# EAGLE design omenpia (EAGLE 9.1.3)
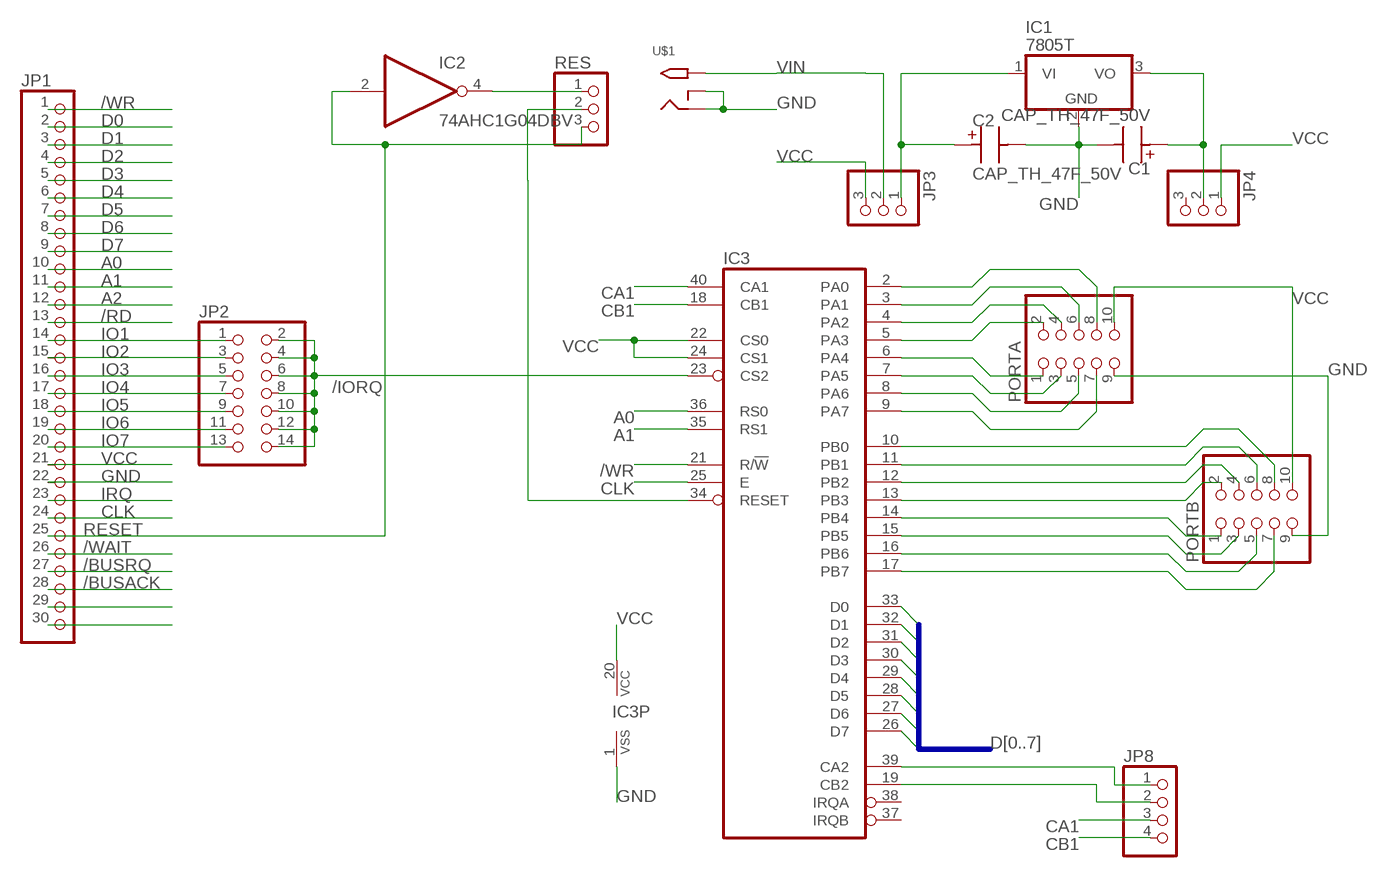
[diagram p0: schematic, sheet 1]

## Parts
C1  CAP_TH_47F_50V  [CAP_TH_P25_D63_POL]
C2  CAP_TH_47F_50V  [CAP_TH_P25_D63_POL]
IC1  7805T  [TO220H]
IC2  74AHC1G04DBV  [SOT23-5]
IC3  6821  [DIL40]
JP1  PINHD-1X30  [1X30]
JP2  PINHD-2X7  [2X07]
JP3  PINHD-1X3  [1X03]
JP4  PINHD-1X3  [1X03]
JP8  PINHD-1X4  [1X04]
PORTA  PINHD-2X5  [2X05]
PORTB  PINHD-2X5  [2X05]
RES  PINHD-1X3  [1X03]
U$1  2.1MMJACKTHM  [PJ-102A]

## Nets
/BUSACK: JP1.28
/BUSRQ: JP1.27
/IORQ: IC3.23(CS2) JP2.2 JP2.4 JP2.6 JP2.8 JP2.10 JP2.12 JP2.14
/RD: JP1.13
/WAIT: JP1.26
/WR: IC3.21(R/!W) JP1.1
A0: IC3.36(RS0) JP1.10
A1: IC3.35(RS1) JP1.11
A2: JP1.12
CA1: IC3.40(CA1) JP8.3
CB1: IC3.18(CB1) JP8.4
CLK: IC3.25(E) JP1.24
D0: IC3.33(D0) JP1.2
D1: IC3.32(D1) JP1.3
D2: IC3.31(D2) JP1.4
D3: IC3.30(D3) JP1.5
D4: IC3.29(D4) JP1.6
D5: IC3.28(D5) JP1.7
D6: IC3.27(D6) JP1.8
D7: IC3.26(D7) JP1.9
GND: C1.P$M C2.P$M IC1.2(GND) IC3.1(VSS) JP1.22 PORTA.9 PORTB.9 U$1.RING U$1.RING_SW
IO1: JP1.14 JP2.1
IO2: JP1.15 JP2.3
IO3: JP1.16 JP2.5
IO4: JP1.17 JP2.7
IO5: JP1.18 JP2.9
IO6: JP1.19 JP2.11
IO7: JP1.20 JP2.13
IRQ: JP1.23
N$1: IC3.5(PA3) PORTA.2
N$2: C2.P$P IC1.1(VI) JP3.1
N$3: C1.P$P IC1.3(VO) JP4.2
N$4: IC2.4(O) RES.1
N$5: IC3.4(PA2) PORTA.4
N$6: IC3.34(RESET) RES.2
N$7: IC3.3(PA1) PORTA.6
N$8: IC3.2(PA0) PORTA.8
N$9: IC3.6(PA4) PORTA.1
N$10: IC3.7(PA5) PORTA.3
N$11: IC3.8(PA6) PORTA.5
N$12: IC3.9(PA7) PORTA.7
N$13: IC3.10(PB0) PORTB.8
N$14: IC3.13(PB3) PORTB.2
N$15: IC3.12(PB2) PORTB.4
N$16: IC3.11(PB1) PORTB.6
N$17: IC3.14(PB4) PORTB.1
N$18: IC3.15(PB5) PORTB.3
N$19: IC3.16(PB6) PORTB.5
N$20: IC3.17(PB7) PORTB.7
N$21: IC3.39(CA2) JP8.1
N$22: IC3.19(CB2) JP8.2
N$29: JP1.29
N$30: JP1.30
RESET: IC2.2(I) JP1.25 RES.3
VCC: IC3.20(VCC) IC3.22(CS0) IC3.24(CS1) JP1.21 JP3.3 JP4.1 PORTA.10 PORTB.10
VIN: JP3.2 U$1.TIP
Unconnected: IC3.37(IRQB) IC3.38(IRQA) JP4.3

## Buses
D[0..7]

## Power pins joined to a net without a drawn wire
GND: IC2.3(GND)
VCC: IC2.5(VCC)

## Library data of the parts
C1 C2 = Seeed-OPL-2017-01-Capacitor-akita:CAP_TH_47F_50V: DIP CAP Aluminum 47uF-50V;Radial-D6.3*H11.0mm SKU: 302030036
IC1 = adafruit:78*: Positive VOLTAGE REGULATOR Added bigger pads to the TO-92 package
IC2 = 74xx-little-us:74*1G04: INVERTER Gate
IC3 = micro-motorola:6821: MICROCONTROLLER/MEMORY DEVICE; MF: NTE ELECTRONICS; MPN: NTE6821; OC_FARNELL: 1652403; OC_NEWARK: 29C4772
JP1 = pinhead:PINHD-1X30: PIN HEADER
JP2 = pinhead:PINHD-2X7: PIN HEADER
JP3 JP4 RES = pinhead:PINHD-1X3: PIN HEADER
JP8 = pinhead:PINHD-1X4: PIN HEADER
PORTA PORTB = pinhead:PINHD-2X5: PIN HEADER
U$1 = adafruit:2.1MMJACK: 2.1mm x 5.5mm THM DC jack with internal switch. Digikey part #PJ-102A, 4UCON part #05537 2.1mm x 5.5mm SMT DC jack with internal switch. Digikey part #PJ-002A-SMT, 4UCON part #03267 By microbuilder.eu & adafruit.com

## Board
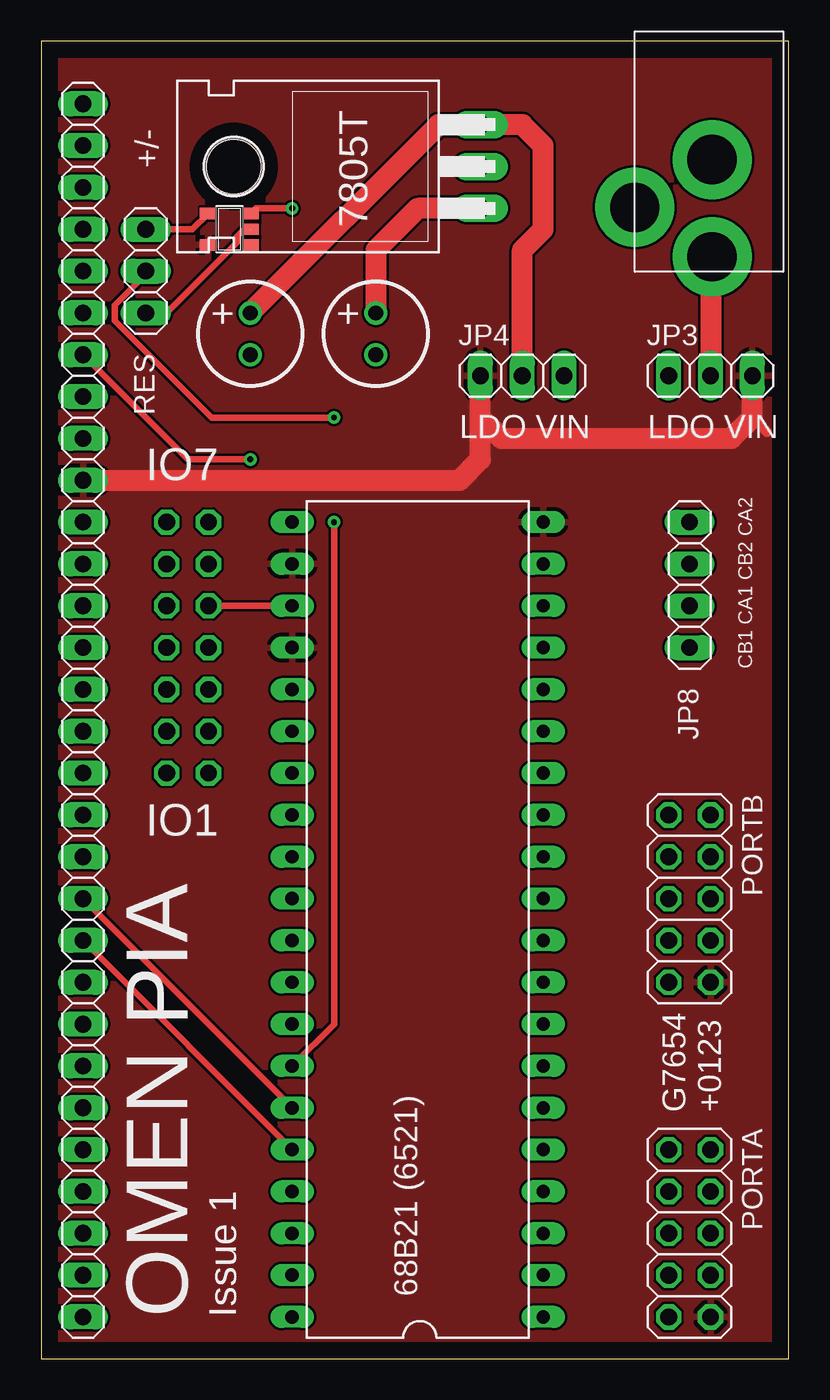
[diagram p1: board, top side]
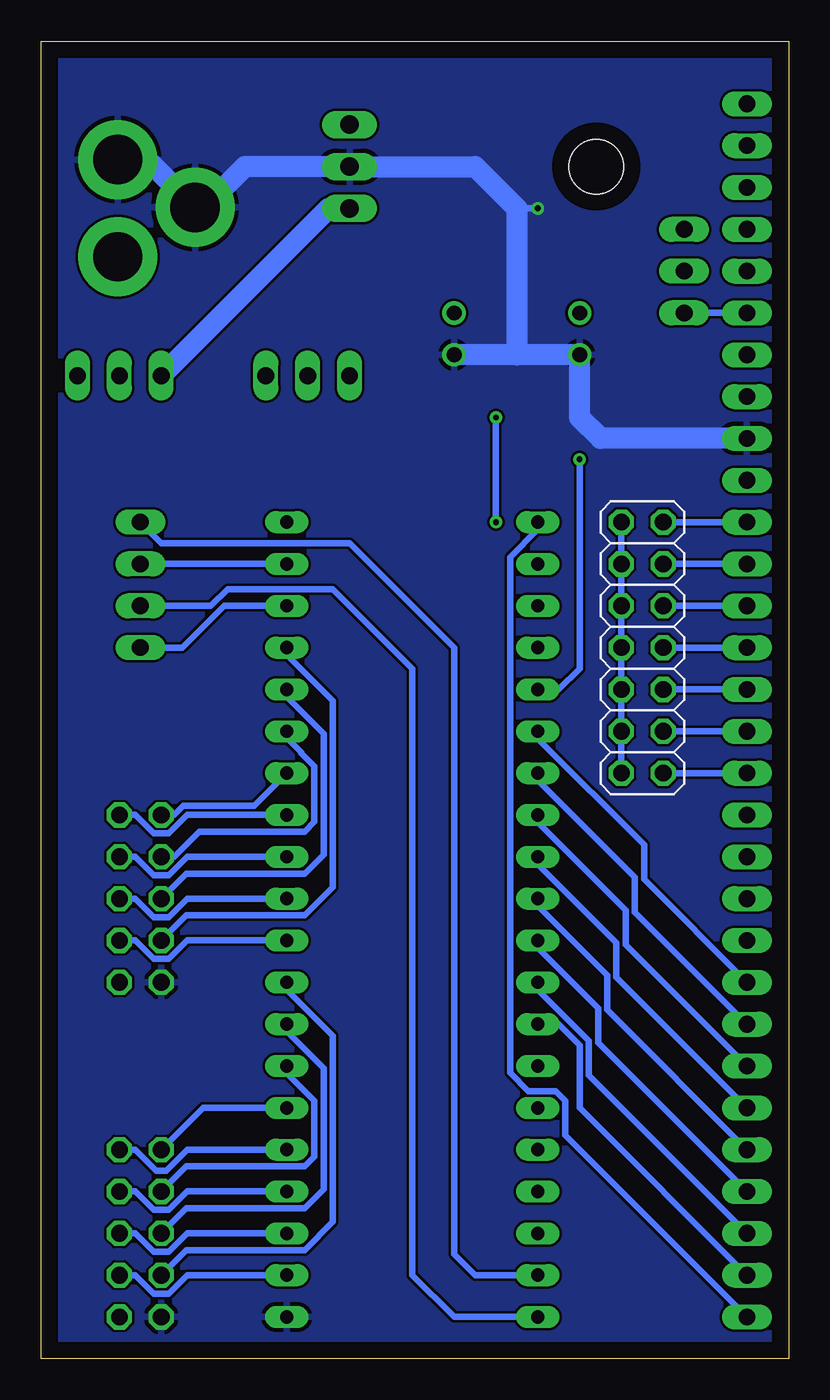
[diagram p2: board, bottom side, seen from below]

Size 45.39 x 80 mm. Coordinates in mm from the lower left corner, seen from the top.
Outline: 0,0 45.39,0 45.39,80 0,80 0,0
Copper layers (1*16): Top 0.035mm / dielectric 1.5mm / Bottom 0.035mm
Design rules "default": minimum track width 6mil, minimum drill 0.35mm, track to track 6mil, track to pad 6mil, pad to pad 6mil, via to via 6mil, smd to smd 6mil, copper to edge 40mil, drill to drill 6mil, minimum pad ring 10mil, minimum via ring 8mil, stop-mask expansion 4mil, vias tented up to drill 0mil, thermal gap 10mil

### Footprints (pad centres in the part's own frame; a part is rotated, then mirrored left to right if it is on the bottom)
CAP_TH_P25_D63_POL = drill 0.9: P$M 1.27,0; P$P -1.27,0
TO220H = drill 1.118 long: 1 -2.54,-10.16; 2 0,-10.16; 3 2.54,-10.16 | hole 3.302: 0,4.826
SOT23-5 = smd 0.69 x 0.99: 1 -0.95,-1.29; 2 0,-1.29; 3 0.95,-1.29; 4 0.95,1.3; 5 -0.95,1.3
DIL40 = drill 0.813 long: 1 -24.13,-7.62; 2 -21.59,-7.62; 3 -19.05,-7.62; 4 -16.51,-7.62; 5 -13.97,-7.62; 6 -11.43,-7.62; 7 -8.89,-7.62; 8 -6.35,-7.62; 9 -3.81,-7.62; 10 -1.27,-7.62; 11 1.27,-7.62; 12 3.81,-7.62; 13 6.35,-7.62; 14 8.89,-7.62; 15 11.43,-7.62; 16 13.97,-7.62; 17 16.51,-7.62; 18 19.05,-7.62; 19 21.59,-7.62; 20 24.13,-7.62; 21 24.13,7.62; 22 21.59,7.62; 23 19.05,7.62; 24 16.51,7.62; 25 13.97,7.62; 26 11.43,7.62; 27 8.89,7.62; 28 6.35,7.62; 29 3.81,7.62; 30 1.27,7.62; 31 -1.27,7.62; 32 -3.81,7.62; 33 -6.35,7.62; 34 -8.89,7.62; 35 -11.43,7.62; 36 -13.97,7.62; 37 -16.51,7.62; 38 -19.05,7.62; 39 -21.59,7.62; 40 -24.13,7.62
1X30 = drill 1.016 long: 1 -36.83,0; 2 -34.29,0; 3 -31.75,0; 4 -29.21,0; 5 -26.67,0; 6 -24.13,0; 7 -21.59,0; 8 -19.05,0; 9 -16.51,0; 10 -13.97,0; 11 -11.43,0; 12 -8.89,0; 13 -6.35,0; 14 -3.81,0; 15 -1.27,0; 16 1.27,0; 17 3.81,0; 18 6.35,0; 19 8.89,0; 20 11.43,0; 21 13.97,0; 22 16.51,0; 23 19.05,0; 24 21.59,0; 25 24.13,0; 26 26.67,0; 27 29.21,0; 28 31.75,0; 29 34.29,0; 30 36.83,0
2X07 = drill 1.016 octagon: 1 -7.62,-1.27; 2 -7.62,1.27; 3 -5.08,-1.27; 4 -5.08,1.27; 5 -2.54,-1.27; 6 -2.54,1.27; 7 0,-1.27; 8 0,1.27; 9 2.54,-1.27; 10 2.54,1.27; 11 5.08,-1.27; 12 5.08,1.27; 13 7.62,-1.27; 14 7.62,1.27
1X03 = drill 1.016 long: 1 -2.54,0; 2 0,0; 3 2.54,0
1X04 = drill 1.016 long: 1 -3.81,0; 2 -1.27,0; 3 1.27,0; 4 3.81,0
2X05 = drill 1.016 octagon: 1 -5.08,-1.27; 2 -5.08,1.27; 3 -2.54,-1.27; 4 -2.54,1.27; 5 0,-1.27; 6 0,1.27; 7 2.54,-1.27; 8 2.54,1.27; 9 5.08,-1.27; 10 5.08,1.27
PJ-102A = drill 3 pad 4.8: RING 0.1,-3.39; RING_SW -4.6,-6.29; TIP 0.1,-9.29

### Placement (x,y rotation side)
C1  12.7,62.23 270 top
C2  20.32,62.23 270 top
IC1  16.51,72.39 90 top
IC2  11.43,68.58 90 top
IC3  22.86,26.67 90 top
JP1  2.54,39.37 90 top
JP2  8.89,43.18 90 bottom
JP3  40.64,59.69 0 top
JP4  29.21,59.69 0 top
JP8  39.37,46.99 270 top
PORTA  39.37,7.62 270 top
PORTB  39.37,27.94 270 top
RES  6.35,66.04 270 top
U$1  40.64,76.2 0 top

### Tracks (layer width: path | path; a pad name or v marks a point on that pad's centre or on a via)
/IORQ
  Top 0.406: IC3.23 JP2.10
  Bottom 0.406: JP2.14 JP2.12 JP2.10 JP2.8 JP2.6 JP2.4 JP2.2
/WR
  Bottom 0.406: IC3.21 15.24,50.36 16.92,48.68 16.92,17.36 15.81,16.26 14.16,16.26 13.56,15.66 13.56,13.56 JP1.1
A0
  Top 0.406: JP1.10 IC3.36
A1
  Top 0.406: JP1.11 IC3.35
CA1
  Bottom 0.406: JP8.3 35.08,45.72 34.06,46.74 27.69,46.74 22.86,41.91 22.86,5.08 20.32,2.54 IC3.40
CB1
  Bottom 0.406: IC3.18 34.29,45.72 36.83,43.18 JP8.4
CLK  (via drill 0.35)
  Top 0.406: JP1.24 8.89,54.61 v12.7,54.61
  Bottom 0.406: IC3.25 13.97,40.64 12.7,41.91 v12.7,54.61
D0
  Bottom 0.406: JP1.2 12.7,15.24 12.7,19.05 13.97,20.32 IC3.33
D1
  Bottom 0.406: JP1.3 12.14,17.22 12.14,19.32 15.24,22.42 IC3.32
D2
  Bottom 0.406: JP1.4 11.58,19.2 11.58,21.3 15.24,24.96 IC3.31
D3
  Bottom 0.406: JP1.5 11.02,21.18 11.02,23.28 15.24,27.5 IC3.30
D4
  Bottom 0.406: JP1.6 10.46,23.16 10.46,25.26 15.24,30.04 IC3.29
D5
  Bottom 0.406: JP1.7 9.91,25.15 9.91,27.24 15.24,32.58 IC3.28
D6
  Bottom 0.406: JP1.8 9.35,27.13 9.35,29.22 15.24,35.12 IC3.27
D7
  Bottom 0.406: JP1.9 8.79,29.11 8.79,31.21 15.24,37.66 IC3.26
GND  (via drill 0.35)
  Top 0.406: IC2.3 13.04,69.85 v15.24,69.85
  Bottom 0.406: v15.24,69.85 16.51,69.85
  Bottom 1.27: U$1.RING 38.94,72.81 U$1.RING_SW 35.98,69.85 35.56,69.85 33.02,72.39 IC1.2 19.05,72.39 16.51,69.85 16.51,60.96 | JP1.22 11.43,55.88 12.7,57.15 C1.P$M 16.51,60.96 | 16.51,60.96 C2.P$M
  pour Bottom: 0,80.01 45.72,80.01 45.72,0 0,0
IO1
  Bottom 0.406: JP1.14 JP2.1
IO2
  Bottom 0.406: JP1.15 JP2.3
IO3
  Bottom 0.406: JP1.16 JP2.5
IO4
  Bottom 0.406: JP1.17 JP2.7
IO5
  Bottom 0.406: JP1.18 JP2.9
IO6
  Bottom 0.406: JP1.19 JP2.11
IO7
  Bottom 0.406: JP1.20 JP2.13
N$1
  Bottom 0.406: IC3.5 36.52,12.7 37.79,11.43 38.41,11.43 39.68,12.7 PORTA.2
N$2
  Top 1.27: IC1.1 22.86,69.85 20.32,67.31 C2.P$P
  Bottom 1.27: JP3.1 27.94,69.85 IC1.1
N$3
  Top 1.27: C1.P$P 24.13,74.93 IC1.3 29.21,74.93 30.48,73.66 30.48,68.58 29.21,67.31 JP4.2
N$4
  Top 0.406: RES.1 9.18,68.58 IC2.4
N$5
  Bottom 0.406: IC3.4 36.52,10.16 37.64,9.04 38.56,9.04 39.68,10.16 PORTA.4
N$6  (via drill 0.35)
  Top 0.406: IC3.34 17.78,20.32 v17.78,50.8 | RES.2 6.35,65.84 4.47,63.96 4.47,63.04 10.36,57.15 v17.78,57.15
  Bottom 0.406: v17.78,50.8 v17.78,57.15
N$7
  Bottom 0.406: IC3.3 36.52,7.62 37.64,6.5 38.56,6.5 39.68,7.62 | 39.68,7.62 PORTA.6 39.68,7.62
N$8
  Bottom 0.406: IC3.2 36.52,5.08 37.64,3.96 38.56,3.96 39.68,5.08 PORTA.8
N$9
  Bottom 0.406: IC3.6 35.56,15.24 PORTA.1
N$10
  Bottom 0.406: PORTA.3 36.58,11.68 29.4,11.68 28.8,12.28 28.8,15.66 30.48,17.34 IC3.7
N$11
  Bottom 0.406: IC3.8 30.48,19.88 28.25,17.64 28.25,10.3 29.4,9.14 36.58,9.14 PORTA.5
N$12
  Bottom 0.406: IC3.9 30.48,22.42 27.69,19.62 27.69,8.32 29.4,6.6 36.58,6.6 PORTA.7
N$13
  Bottom 0.406: PORTB.8 39.68,25.4 38.56,24.28 37.64,24.28 36.52,25.4 IC3.10
N$14
  Bottom 0.406: PORTB.2 39.68,33.02 38.56,31.9 37.64,31.9 36.52,33.02 IC3.13
N$15
  Bottom 0.406: PORTB.4 39.68,30.48 38.56,29.36 37.64,29.36 36.52,30.48 IC3.12
N$16
  Bottom 0.406: PORTB.6 39.68,27.94 38.56,26.82 37.64,26.82 36.52,27.94 IC3.11
N$17
  Bottom 0.406: PORTB.1 37.31,33.02 36.75,33.58 32.46,33.58 IC3.14
N$18
  Bottom 0.406: PORTB.3 37.31,30.48 35.79,32 29.4,32 28.8,32.6 28.8,35.98 29.59,36.77 29.59,36.83 30.48,37.72 IC3.15
N$19
  Bottom 0.406: IC3.16 30.48,40.2 28.25,37.96 28.25,30.62 29.4,29.46 36.58,29.46 PORTB.5
N$20
  Bottom 0.406: IC3.17 30.48,42.74 27.69,39.94 27.69,28.64 29.4,26.92 36.58,26.92 PORTB.7
N$21
  Bottom 0.406: JP8.1 38.1,49.53 26.67,49.53 20.32,43.18 20.32,6.35 19.05,5.08 IC3.39
N$22
  Bottom 0.406: IC3.19 JP8.2
RESET
  Top 0.406: RES.3 7.62,63.5 11.87,67.75 11.87,68.12 12.33,68.58 IC2.2
  Bottom 0.406: JP1.25 RES.3
VCC
  Top 0.406: 14.29,53.02 13.97,53.34
  Top 0.61: 44.07,56.26 43.18,57.15
  Top 1.27: JP1.21 13.97,53.34 25.4,53.34 26.67,54.61 26.67,57.15 | 26.67,57.15 JP4.1 | 26.67,57.15 27.94,55.88 41.91,55.88 43.18,57.15 JP3.3
  pour Top: 0,80.01 45.72,80.01 45.72,0 0,0
VIN
  Top 1.27: U$1.TIP 40.64,66.81 JP3.2

### Text on the board
tNames: +/- | + | + | LDO VIN | LDO VIN | IO7 | CB1 CA1 CB2 CA2 | IO1 | G7654 / +0123 | 68B21 (6521) | OMEN PIA | Issue 1